# Altium project GAP_Shield.PrjPcb
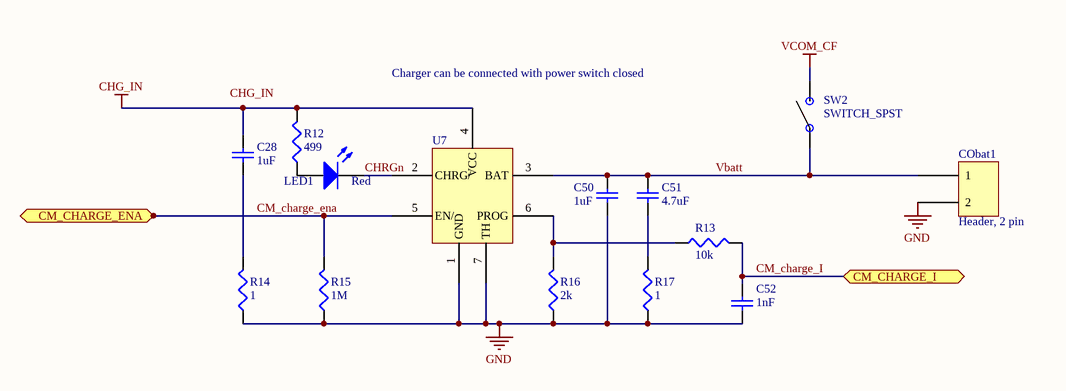
[diagram p0: BatteryCharge.SchDoc]
4 sheets, 110 parts. Net scope: global (net labels, ports and power ports of the same name join across sheets).
Board file: PCB1.PcbDoc
Sheets:
  BatteryCharge.SchDoc
  Power.SchDoc
  GAPandPeripherals.SchDoc
  Communications.SchDoc

## Sheet BatteryCharge.SchDoc
size A4

### Parts
C28  value 1uF  [0402]  (hidden comment: C1005X5R1C105M050BC)
C50  value 1uF  [0402]  (hidden comment: C1005X5R1C105M050BC)
C51  value 4.7uF  [0402]  (hidden comment: GRM188R6YA475KE15D)
C52  value 1nF  [0402]  (hidden comment: GRM155R61H102KA01D)
CObat1  Header, 2 pin  [Pin Header, 1x2, TH]
LED1  Color: Red  [0603]
R12  value 499  [0402]  (hidden comment: ERJ-2RKF4990X)
R13  value 10k  [0402]  (hidden comment: ERJ-2RKF1002X)
R14  value 1  [0402]  (hidden comment: ERJ-2BQF1R0X)
R15  value 1M  [0402]  (hidden comment: ERJ-2RKF1004X)
R16  value 2k  [0402]  (hidden comment: ERJ-2RKF2001X)
R17  value 1  [0402]  (hidden comment: ERJ-2BQF1R0X)
SW2  SWITCH_SPST  [SWITCH_SPST_CHS-01TB]
U7  LTC4065EDC#TRMPBF  [DFN-6_LT]  (value not drawn)

### Ports
CM_CHARGE_ENA (bidir), CM_CHARGE_I (bidir)

### Nets
CHG_IN: C28.2 R12.2 U7.4(VCC)
GND: C50.1 C52.1 CObat1.2 R14.1 R15.1 R16.1 R17.1 U7.1(GND) U7.7(TH)
VCOM_CF: SW2.1
CHRGn: LED1.2(K) U7.2(CHRG/)
CM_charge_ena: R15.2 U7.5(EN/) ; port CM_CHARGE_ENA
CM_charge_I: C52.2 R13.2 ; port CM_CHARGE_I
Vbatt: C50.2 C51.2 CObat1.1 SW2.2 U7.3(BAT)
NetC28_1: C28.1 R14.2
NetC51_1: C51.1 R17.2
NetLED1_1: LED1.1(A) R12.1
NetR13_1: R13.1 R16.2 U7.6(PROG)

### Notes on the sheet
- Charger can be connected with power switch closed
- Labels drawn without touching a wire or pin: CHG_IN

### Library data of the parts
C28 C50 = Cap: CAP CER 1UF 16V X5R 0402; Manufacturer: TDK; Supplier: Digikey; Supplier PN: 445-9073-1-ND; Manufacturer PN: C1005X5R1C105M050BC
C51 = Cap: CAP CER 4.7UF 35V X5R 0603; Manufacturer: Murata; Supplier: Digikey; Supplier PN: 490-7205-1-ND; Manufacturer PN: GRM188R6YA475KE15D
C52 = Cap: CAP CER 1000PF 50V X5R 0402; Manufacturer: Murata; Supplier: Digikey; Supplier PN: 490-6316-1-ND; Manufacturer PN: GRM155R61H102KA01D
CObat1 = Header, 2 pin: Header 1x2; Manufacturer: Samtec; Manufacturer PN: TMM-102-03-T-S; Supplier: Digikey; Supplier PN: SAM8977-ND
LED1 = LED: LED RED CLEAR 0603 SMD; Manufacturer: Rohm; Manufacturer PN: SML-311UTT86; Supplier: Digikey; Supplier PN: 511-1304-1-ND
R12 = Resistor: RES SMD 499 OHM 1% 1/10W 0402; Manufacturer: Panasonic; Manufacturer PN: ERJ-2RKF4990X; Supplier: Digikey; Supplier P/N: P499LCT-ND; Power: 1/10W; Package: 0402
R13 = Resistor: RES SMD 10K OHM 1% 1/10W 0402; Manufacturer: Panasonic; Manufacturer PN: ERJ-2RKF1002X; Supplier: Digikey; Supplier P/N: P10.0KLCT-ND; Power: 1/10W; Package: 0402
R14 R17 = Resistor: RES SMD 1 OHM 1% 1/6W 0402; Manufacturer: Panasonic; Manufacturer PN: ERJ-2BQF1R0X; Supplier: Digikey; Supplier P/N: P17252CT-ND; Power: 1/6W; Package: 0402
R15 = Resistor: RES SMD 1M OHM 1% 1/10W 0402; Manufacturer: Panasonic; Manufacturer PN: ERJ-2RKF1004X; Supplier: Digikey; Supplier P/N: P1.00MLCT-ND; Power: 1/10W; Package: 0402
R16 = Resistor: RES SMD 2K OHM 1% 1/10W 0402; Manufacturer: Panasonic; Manufacturer PN: ERJ-2RKF2001X; Supplier: Digikey; Supplier P/N: P2.00KLCT-ND; Power: 1/10W; Package: 0402
SW2 = SWITCH_SPST: SWITCH SLIDE DIP SPST 100MA 6V; Manufacturer: Copal; Manufacturer PN: CHS-01TB; Supplier: Digikey; Supplier PN: 563-1004-1-ND
U7 = LTC4065EDC: IC CHARGER BATT LI-ON 6-DFN; Manufacturer: LT; Note: 4.4v float version is available (4.2 is standard): LTC4065EDC-4.4; Manufacturer PN: LTC4065EDC#TRMPBF; Supplier: Digikey; Supplier PN: LTC4065EDC#TRMPBFCT-ND

## Sheet Power.SchDoc: PULP - shield - GAP
size A4; Revision: 1.1; SheetNumber: 2; SheetTotal: 2
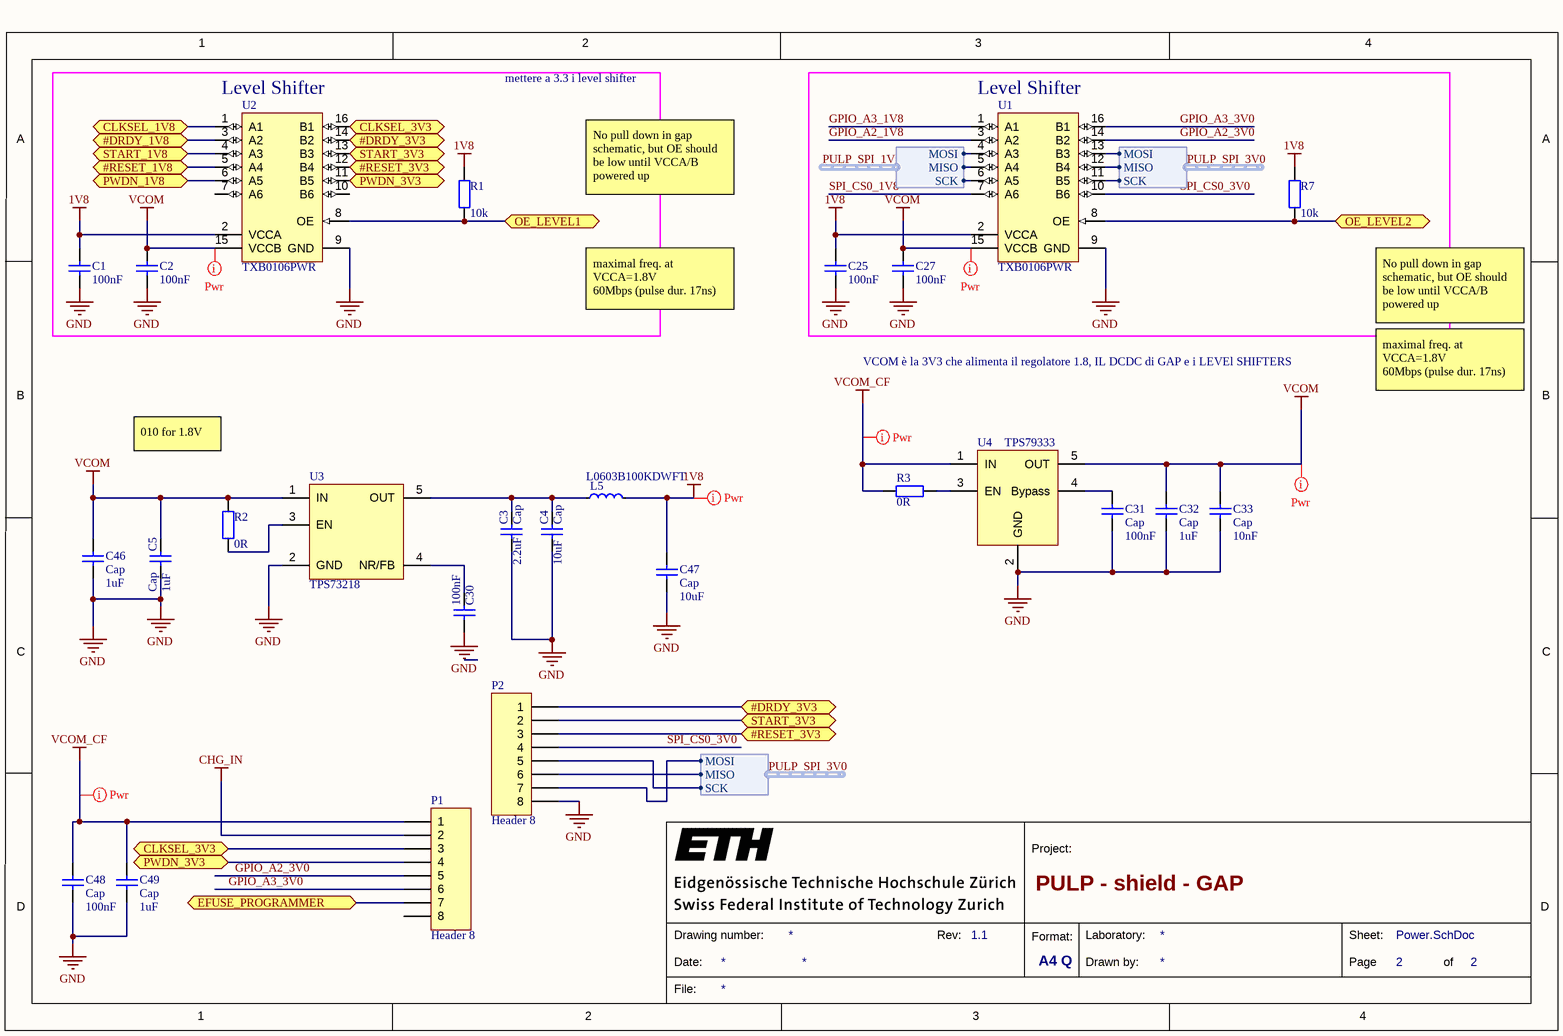
[diagram p1: Power.SchDoc]

### Parts
C1  100nF  [CAPC0402(1005)60_N]
C2  100nF  [CAPC0402(1005)60_N]
C3  Cap  value 2.2uF  [cap_0402_R - modified]
C4  Cap  value 10uF  [cap_0402_R - modified]
C5  Cap  value 1uF  [cap_0402_R - modified]
C25  100nF  [CAPC0402(1005)60_N]
C27  100nF  [CAPC0402(1005)60_N]
C30  value 100nF  [cap_0402_R - modified]  (hidden comment: C)
C31  Cap  value 100nF  [cap_0402_R - modified]
C32  Cap  value 1uF  [cap_0402_R - modified]
C33  Cap  value 10nF  [cap_0402_R - modified]
C46  Cap  value 1uF  [CAPC0402(1005)60_N]
C47  Cap  value 10uF  [CAPC0402(1005)60_N]
C48  Cap  value 100nF  [cap_0402_R - modified]
C49  Cap  value 1uF  [cap_0402_R - modified]
L5  L0603B100KDWFT  [SMD 0805_A]
P1  Header 8  [HDR1X8]
P2  Header 8  [HDR1X8]
R1  value 10k  [cap_0402_R - modified]  (hidden comment: R)
R2  value 0R  [cap_0402_R - modified]  (hidden comment: R)
R3  value 0R  [cap_0402_R - modified]  (hidden comment: R)
R7  value 10k  [cap_0402_R - modified]  (hidden comment: R)
U1  TXB0106PWR  [PW0016A_L]
U2  TXB0106PWR  [PW0016A_L]
U3  TPS73218  [SOT23__DDC__(R - PDSO-  G5)]
U4  TPS79333  [SOT_23__DBV_(R - PDSO - G5)]

### Blocks framed on the sheet
Level Shifter: C1 C2 R1 U2
Level Shifter: C25 C27 R7 U1

### Ports
#DRDY_1V8, #DRDY_3V3, #RESET_1V8, #RESET_3V3, CLKSEL_1V8, CLKSEL_3V3, EFUSE_PROGRAMMER, OE_LEVEL1, OE_LEVEL2, PWDN_1V8, PWDN_3V3, START_1V8, START_3V3

### Harnesses
SPI: SCK, MISO, MOSI

### Nets
1V8: C1.2 C25.2 C47.2 L5.2 R1.2 R7.2 U1.2(VCCA) U2.2(VCCA)
CHG_IN: P1.2
GND: C1.1 C2.2 C3.2 C4.2 C5.2 C25.1 C27.2 C30.2 C31.1 C32.2 C33.1 C46.1 C47.1 C48.1 C49.2 P2.8 U1.9(GND) U2.9(GND) U3.2(GND) U4.2(GND)
VCOM: C2.1 C5.1 C27.1 C32.1 C33.2 C46.2 R2.2 U1.15(VCCB) U2.15(VCCB) U3.1(IN) U4.5(OUT)
VCOM_CF: C48.2 C49.1 P1.1 R3.2 U4.1(IN)
GPIO_A2_1V8: U1.3(A2)
GPIO_A2_3V0: P1.5 U1.14(B2)
GPIO_A3_1V8: U1.1(A1)
GPIO_A3_3V0: P1.6 U1.16(B1)
PULP_SPI_1V8.MISO: U1.5(A4) ; harness SPI.MISO
PULP_SPI_1V8.MOSI: U1.4(A3) ; harness SPI.MOSI
PULP_SPI_1V8.SCK: U1.6(A5) ; harness SPI.SCK
PULP_SPI_3V0.MISO: P2.6 U1.12(B4) ; harness SPI.MISO
PULP_SPI_3V0.MOSI: P2.7 U1.13(B3) ; harness SPI.MOSI
PULP_SPI_3V0.SCK: P2.5 U1.11(B5) ; harness SPI.SCK
SPI_CS0_1V8: U1.7(A6)
SPI_CS0_3V0: P2.4 U1.10(B6)
NetC3_1: C3.1 C4.1 L5.1 U3.5(OUT)
NetC30_1: C30.1 U3.4(NR/FB)
NetC31_2: C31.2 U4.4(Bypass)
NetJ2_1: P1.7 ; port EFUSE_PROGRAMMER
NetP1_3: P1.3 U2.16(B1) ; port CLKSEL_3V3
NetP1_4: P1.4 U2.11(B5) ; port PWDN_3V3
NetP2_1: P2.1 U2.14(B2) ; port #DRDY_3V3
NetP2_2: P2.2 U2.13(B3) ; port START_3V3
NetP2_3: P2.3 U2.12(B4) ; port #RESET_3V3
NetR1_1: R1.1 U2.8(OE) ; port OE_LEVEL1
NetR2_1: R2.1 U3.3(EN)
NetR3_1: R3.1 U4.3(EN)
NetR7_1: R7.1 U1.8(OE) ; port OE_LEVEL2
NetR11_2: U2.3(A2) ; port #DRDY_1V8
NetU2_1: U2.1(A1) ; port CLKSEL_1V8
NetU2_4: U2.4(A3) ; port START_1V8
NetU2_5: U2.5(A4) ; port #RESET_1V8
NetU2_6: U2.6(A5) ; port PWDN_1V8

Not connected (* = marked no-connect by the designer): P1 8; U2 7(A6) 10(B6)

### Layout directives
net class POWER: 1V8, VCOM, VCOM_CF

### Notes on the sheet
- mettere a 3.3 i level shifter
- No pull down in gap schematic, but OE should be low until VCCA/B powered up
- maximal freq. at VCCA=1.8V
  60Mbps (pulse dur. 17ns)
- VCOM è la 3V3 che alimenta il regolatore 1.8, IL DCDC di GAP e i LEVEl SHIFTERS
- 010 for 1.8V
- 1
- 2
- 3
- 4
- A
- B
- C
- Project:
- D
- Date:
- Drawing number:
- Rev:
- Format:
- A4 Q
- Drawn by:
- Laboratory:
- Page
- Sheet:
- of
- File:

### Library data of the parts
C1 C2 C25 C27 = CMP-1034-02065-1: CAP 100nF 10V ±10% 0402 (1005 Metric) Thickness 0.6mm SMD; Case-EIA: 0402; Case-Metric: 1005; Tolerance: Â±10%; Max Thickness: 0.6 mm; Value: 100nF; Rated Voltage: 10 V; Technology: SMT
C3-C5 C30-C33 C46-C49 = Cap: Capacitor; Published: 8-Jun-2000; LatestRevisionDate: 17-Jul-2002; LatestRevisionNote: Re-released for DXP Platform.; PackageReference: RAD-0.3; Publisher: Altium Limited; PackageDescription: Radial Cap, Thru-Hole; 2 Leads; 0.3 in Pin Spacing
L5 = IND: Power Multilayer Inductor WE-PMI, L=2.20 µH; Part Number: L0603-10µ; Manufacturer: Taiyo Yuden; Manufacturer Part Number: LBMF1608T100K; 2nd source part number: 178-6105; Value: 2.2µH; Note: LBMF1608T100K 10µH 80mA 0603; Artikkelnr Noca: 33029314; Artikkelnr Simpro: N.A.; Datasheet: http://www.yuden.co.jp/ut/product/pdf/elb2_e.pdf; LatestRevisionDate: 2012-09-19; Pin Count: 2; Publisher: Nordic Semiconductor; Published: 2010-02-24; Supplier: Digi-Key; Supplier part number: 587-1714-1-ND; 2nd source Supplier: Farnell; Footprint Doc: Power Multilayer Inductor WE-PMI, L=2.20 µH
P1 P2 = Header 8: Header, 8-Pin; LatestRevisionDate: 17-Jul-2002; LatestRevisionNote: Re-released for DXP Platform.; Publisher: Altium Limited
R1-R3 R7 = Res2: Resistor; Published: 8-Jun-2000; LatestRevisionDate: 17-Jul-2002; LatestRevisionNote: Re-released for DXP Platform.; PackageReference: AXIAL-0.4; Publisher: Altium Limited; PackageDescription: Axial Device, Thru-Hole; 2 Leads; 0.4 in Pin Spacing
U1 U2 = TI-TXB0106-TSSOP_PW-16: 6-Bit Bidirectional Level-Shifting and Voltage Translator with Auto-Direction Sensing and +/- 15-kV ESD Protection, 1.2 to 3.6 V, -40 to 85 degC, 16-Pin TSSOP (PW), Green (RoHS & no Sb/Br), Tape and Reel; Manufacturer: Texas Instruments; Dynamic Catalog: TXBSeries; Differential - Input: Output:No/No; Number of Bits: 6; Output Type: Logic; Propagation Delay (Max): 4ns; Number of Outputs/Channel: 1; Voltage - Supply: 1.2V~3.6V,1.65V~5.5V; Data Rate: 100Mbps; Product Training Modules: VoltageLevelTranslation; Other Names: 296-23759-1; Logic Function: Translator,Bidirectional; Packaging: CutTape(CT); Datasheet URL: http://www.ti.com/general/docs/lit/getliterature.tsp?genericPartNumber=TXB0106&fileType=pdf; Package Description: 16-Pin Small Outline Package Integrated Circuit, Body 5 x 4.4 mm, Pitch 0.65 mm; Standard Package: 1; Series: -; Manufacturer URL: http://www.ti.com/; Operating Temperature: -40°C~85°C; Supplier Device Package: 16-TSSOP; Package Reference: PW16; Number of Channels: 6; Category: IntegratedCircuits(ICs); Package / Case: 16-TSSOP(0.173",4.40mmWidth); Family: Logic-Translators; Datasheet Version: Rev. B, 06/2015; Mounting Technology: SurfaceMount; Input Type: Logic
U3 = TPS73225: Linear Regulator
U4 = TPS79333: Regulator

## Sheet GAPandPeripherals.SchDoc: PULP - shield - GAP
size A3; Revision: 1.1; SheetNumber: 1; SheetTotal: 2
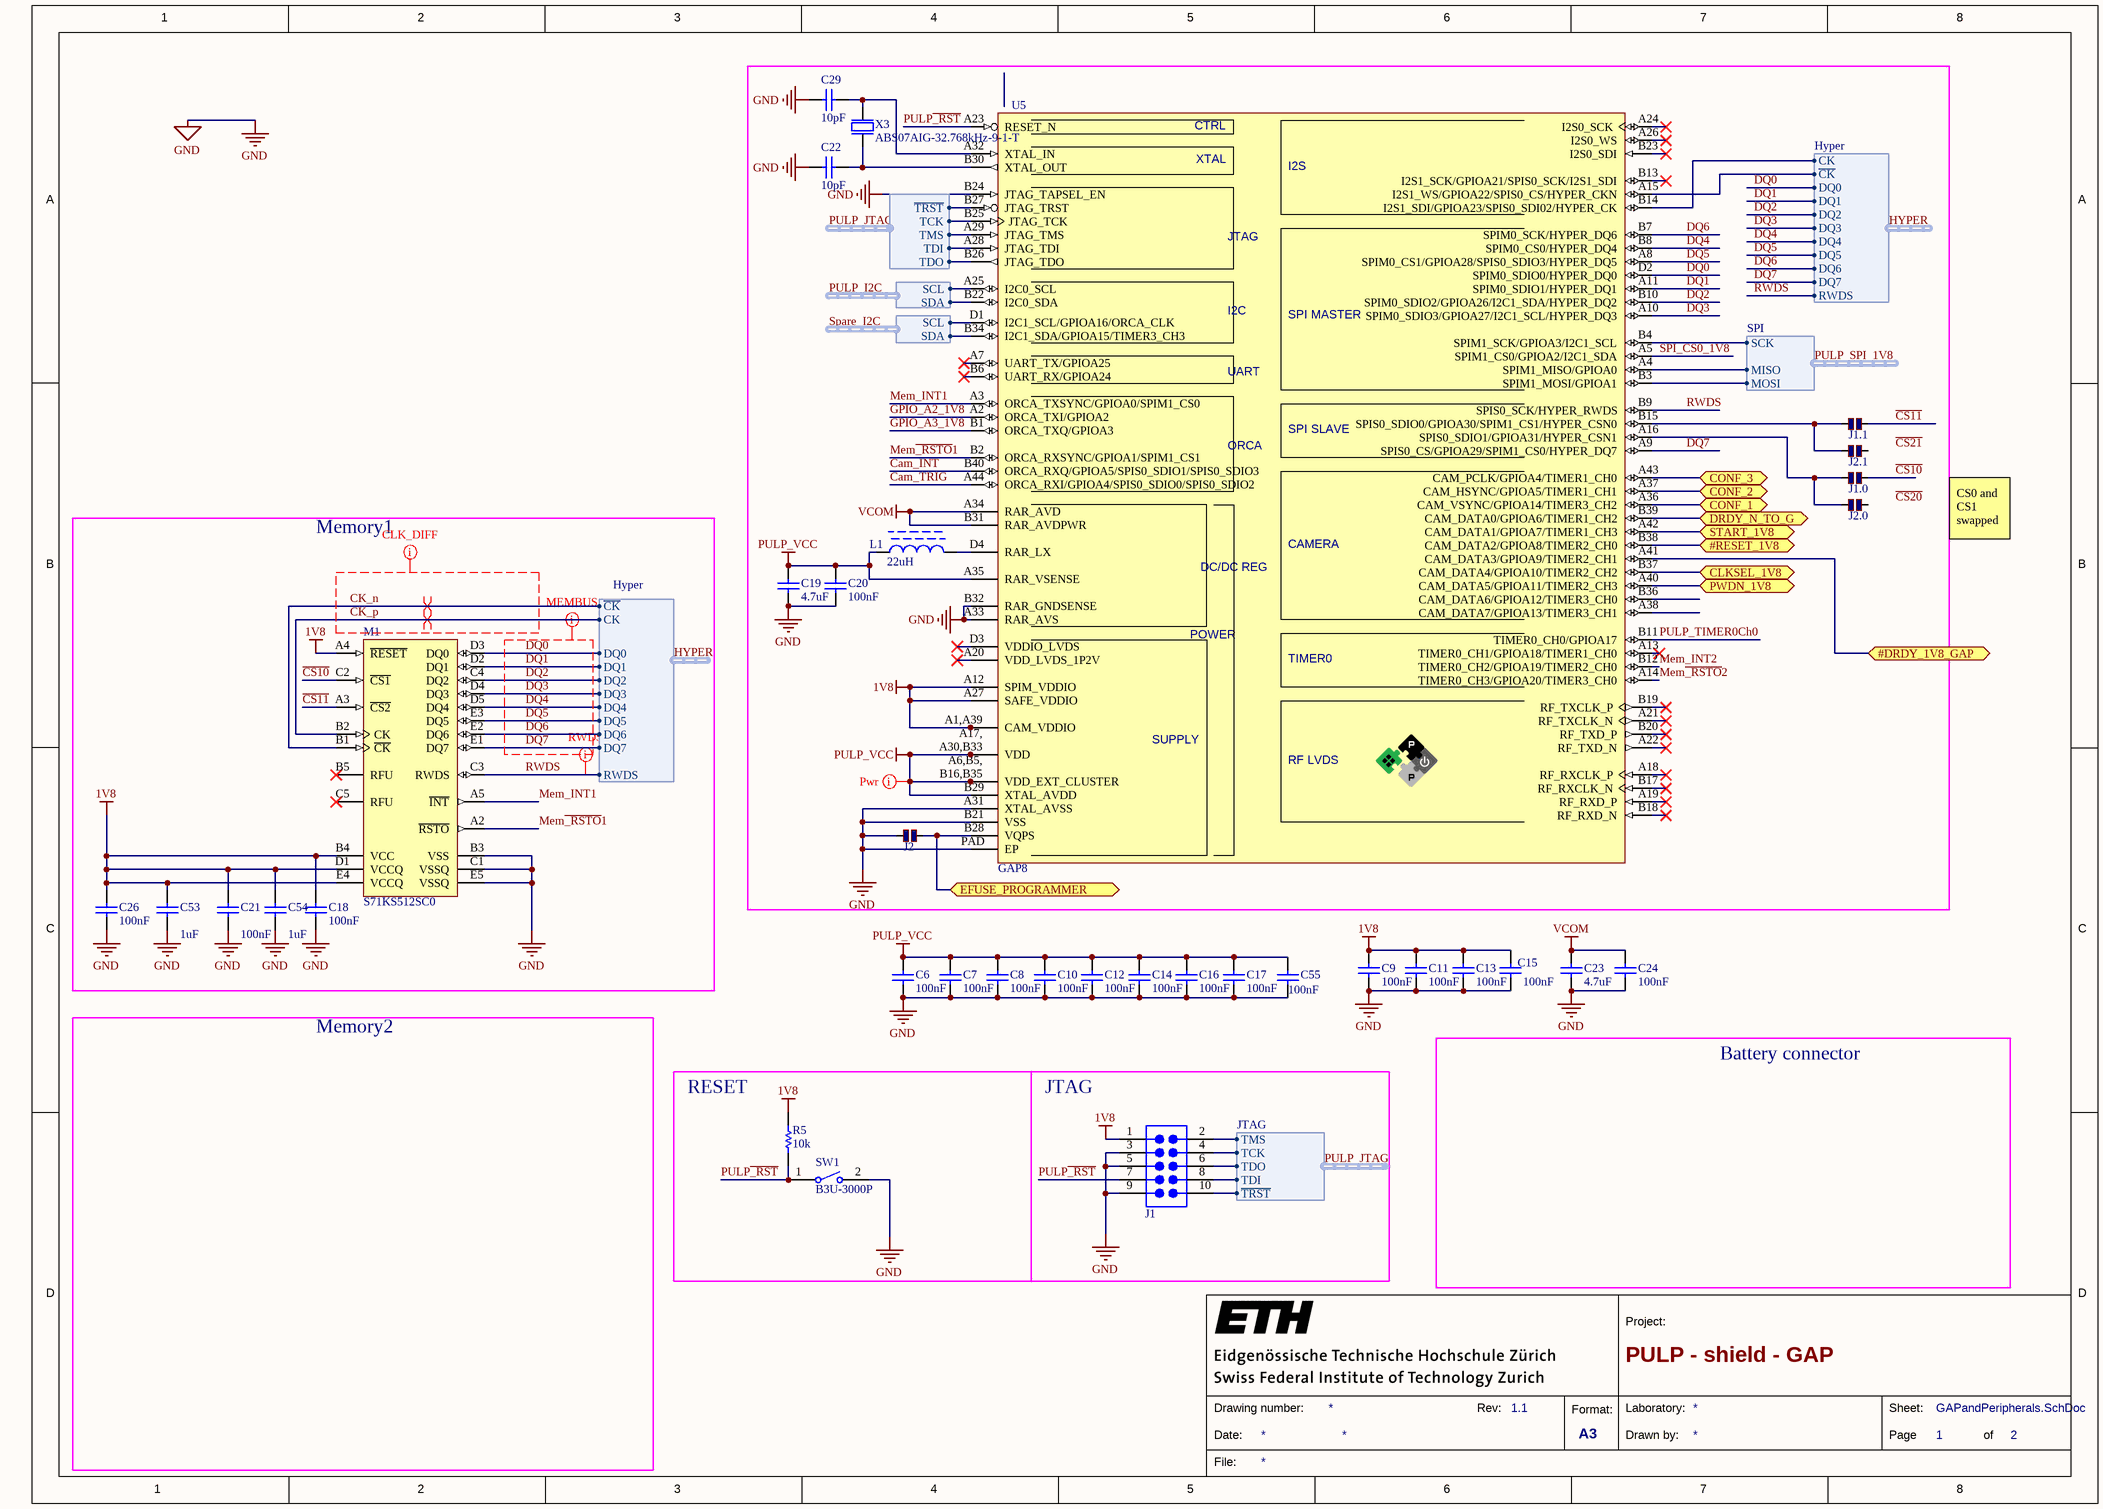
[diagram p2: GAPandPeripherals.SchDoc]

### Parts
C6  100nF  [CAPC0402(1005)60_N]
C7  100nF  [CAPC0402(1005)60_N]
C8  100nF  [CAPC0402(1005)60_N]
C9  100nF  [CAPC0402(1005)60_N]
C10  100nF  [CAPC0402(1005)60_N]
C11  100nF  [CAPC0402(1005)60_N]
C12  100nF  [CAPC0402(1005)60_N]
C13  100nF  [CAPC0402(1005)60_N]
C14  100nF  [CAPC0402(1005)60_N]
C15  100nF  [CAPC0402(1005)60_N]
C16  100nF  [CAPC0402(1005)60_N]
C17  100nF  [CAPC0402(1005)60_N]
C18  100nF  [CAPC0402(1005)60_N]
C19  4.7uF  [CAPC0402(1005)60_N]
C20  100nF  [CAPC0402(1005)60_N]
C21  value 100nF  [0402]  (hidden comment: Cap Semi)
C22  10pF  [CAPC0402(1005)60_L]
C23  4.7uF  [CAPC0402(1005)60_N]
C24  100nF  [CAPC0402(1005)60_N]
C26  100nF  [CAPC0402(1005)60_N]
C29  10pF  [CAPC0402(1005)60_L]
C53  value 1uF  [0402]  (hidden comment: Cap Semi)
C54  value 1uF  [0402]  (hidden comment: Cap Semi)
C55  value 100nF  [0402]  (hidden comment: Cap Semi)
J1  20021111-00010T4LF  [20021111-00010T4LF]  (value not drawn)
J1.0  Solder Jumper  [UJMPR]  (value not drawn)
J1.1  Solder Jumper  [UJMPR]  (value not drawn)
J2  Solder Jumper  [Small Solder Jumper 2]  (value not drawn)
J2.0  Solder Jumper  [UJMPR]  (value not drawn)
J2.1  Solder Jumper  [UJMPR]  (value not drawn)
L1  value 22uH  [SRN4026]  (hidden comment: SRN4026-220M)
M1  S71KS512SC0  [FBGA24_A-130]
R5  10k  [RESC1005X40X25NL05T05]
SW1  B3U-3000P  [OMRON-B3U-3000P_V]
U5  GAP8  [RKC0088A_V]
X3  ABS07AIG-32.768kHz-9-1-T  [ABRA-ABS07-2_V]

### Blocks framed on the sheet
Memory1: C18 C21 C26 C53 C54 M1
RESET: R5 SW1
JTAG: J1

### Ports
#DRDY_1V8_GAP, #RESET_1V8, CLKSEL_1V8, CONF_1, CONF_2, CONF_3, DRDY_N_TO_G, EFUSE_PROGRAMMER, PWDN_1V8, START_1V8

### Harnesses
Hyper: CK, ~{CK}, DQ0, DQ1, DQ2, DQ3, DQ4, DQ5, DQ6, DQ7, RWDS
JTAG: ~{TRST}, TMS, TDO, TDI, TCK
I2C: SDA, SCL
SPI: SCK, MISO, MOSI

### Nets
1V8: C9.2 C11.2 C13.2 C15.2 C18.2 C21.2 C26.2 C53.2 C54.2 J1.1 M1.A4(~{RESET}) M1.B4(VCC) M1.D1(VCCQ) M1.E4(VCCQ) R5.2 U5.A1(CAM_VDDIO) U5.A12(SPIM_VDDIO) U5.A27(SAFE_VDDIO) U5.A39(CAM_VDDIO)
GND: C6.1 C7.1 C8.1 C9.1 C10.1 C11.1 C12.1 C13.1 C14.1 C15.1 C16.1 C17.1 C18.1 C19.1 C20.1 C21.1 C22.1 C23.1 C24.1 C26.1 C29.1 C53.1 C54.1 C55.1 J1.3 J1.5 J1.9 J2.2 M1.B3(VSS) M1.C1(VSSQ) M1.E5(VSSQ) SW1.2 U5.A31(XTAL_AVSS) U5.A33(RAR_AVS) U5.B21(VSS) U5.B24(JTAG_TAPSEL_EN) U5.B32(RAR_GNDSENSE) U5.PAD(EP)
PULP_VCC: C6.2 C7.2 C8.2 C10.2 C12.2 C14.2 C16.2 C17.2 C19.2 C20.2 C55.2 L1.1 U5.A6(VDD_EXT_CLUSTER) U5.A17(VDD) U5.A30(VDD) U5.A35(RAR_VSENSE) U5.B5(VDD_EXT_CLUSTER) U5.B16(VDD_EXT_CLUSTER) U5.B29(XTAL_AVDD) U5.B33(VDD) U5.B35(VDD_EXT_CLUSTER)
VCOM: C23.2 C24.2 U5.A34(RAR_AVD) U5.B31(RAR_AVDPWR)
~{CS10}: J1.0.2 M1.C2(~{CS1})
~{CS11}: J1.1.2 M1.A3(~{CS2})
Cam_INT: U5.B40(ORCA_RXQ/GPIOA5/SPIS0_SDIO1/SPIS0_SDIO3)
Cam_TRIG: U5.A44(ORCA_RXI/GPIOA4/SPIS0_SDIO0/SPIS0_SDIO2)
CK_n: M1.B1(~{CK}) U5.A15(I2S1_WS/GPIOA22/SPIS0_CS/HYPER_CKN) ; harness Hyper.~{CK}
CK_p: M1.B2(CK) U5.B14(I2S1_SDI/GPIOA23/SPIS0_SDI02/HYPER_CK) ; harness Hyper.CK
DQ0: M1.D3(DQ0) U5.D2(SPIM0_SDIO0/HYPER_DQ0) ; harness Hyper.DQ0
DQ1: M1.D2(DQ1) U5.A11(SPIM0_SDIO1/HYPER_DQ1) ; harness Hyper.DQ1
DQ2: M1.C4(DQ2) U5.B10(SPIM0_SDIO2/GPIOA26/I2C1_SDA/HYPER_DQ2) ; harness Hyper.DQ2
DQ3: M1.D4(DQ3) U5.A10(SPIM0_SDIO3/GPIOA27/I2C1_SCL/HYPER_DQ3) ; harness Hyper.DQ3
DQ4: M1.D5(DQ4) U5.B8(SPIM0_CS0/HYPER_DQ4) ; harness Hyper.DQ4
DQ5: M1.E3(DQ5) U5.A8(SPIM0_CS1/GPIOA28/SPIS0_SDIO3/HYPER_DQ5) ; harness Hyper.DQ5
DQ6: M1.E2(DQ6) U5.B7(SPIM0_SCK/HYPER_DQ6) ; harness Hyper.DQ6
DQ7: M1.E1(DQ7) U5.A9(SPIS0_CS/GPIOA29/SPIM1_CS0/HYPER_DQ7) ; harness Hyper.DQ7
GPIO_A2_1V8: U5.A2(ORCA_TXI/GPIOA2)
GPIO_A3_1V8: U5.B1(ORCA_TXQ/GPIOA3)
Mem~{_RSTO}1: M1.A2(~{RSTO}) U5.B2(ORCA_RXSYNC/GPIOA1/SPIM1_CS1)
Mem~{_RSTO}2: U5.A14(TIMER0_CH3/GPIOA20/TIMER3_CH0)
Mem_INT1: M1.A5(~{INT}) U5.A3(ORCA_TXSYNC/GPIOA0/SPIM1_CS0)
Mem_INT2: U5.B12(TIMER0_CH2/GPIOA19/TIMER2_CH0)
PULP~{_RST}: J1.7 R5.1 SW1.1 U5.A23(RESET_N)
PULP_I2C.SCL: U5.A25(I2C0_SCL) ; harness I2C.SCL
PULP_I2C.SDA: U5.B22(I2C0_SDA) ; harness I2C.SDA
PULP_JTAG~{.TRST}: J1.10 U5.B27(JTAG_TRST) ; harness JTAG.~{TRST}
PULP_JTAG.TCK: J1.4 U5.B25(JTAG_TCK) ; harness JTAG.TCK
PULP_JTAG.TDI: J1.8 U5.A28(JTAG_TDI) ; harness JTAG.TDI
PULP_JTAG.TDO: J1.6 U5.B26(JTAG_TDO) ; harness JTAG.TDO
PULP_JTAG.TMS: J1.2 U5.A29(JTAG_TMS) ; harness JTAG.TMS
PULP_SPI_1V8.MISO: U5.A4(SPIM1_MISO/GPIOA0) ; harness SPI.MISO
PULP_SPI_1V8.MOSI: U5.B3(SPIM1_MOSI/GPIOA1) ; harness SPI.MOSI
PULP_SPI_1V8.SCK: U5.B4(SPIM1_SCK/GPIOA3/I2C1_SCL) ; harness SPI.SCK
PULP_TIMER0Ch0: U5.B11(TIMER0_CH0/GPIOA17)
RWDS: M1.C3(RWDS) U5.B9(SPIS0_SCK/HYPER_RWDS) ; harness Hyper.RWDS  [project net HYPER.RWDS]
Spare_I2C.SCL: U5.D1(I2C1_SCL/GPIOA16/ORCA_CLK) ; harness I2C.SCL
Spare_I2C.SDA: U5.B34(I2C1_SDA/GPIOA15/TIMER3_CH3) ; harness I2C.SDA
SPI_CS0_1V8: U5.A5(SPIM1_CS0/GPIOA2/I2C1_SDA)
NetC22_2: C22.2 U5.B30(XTAL_OUT) X3.1(inp)
NetC29_2: C29.2 U5.A32(XTAL_IN) X3.2(out)
NetJ1.0_1: J1.0.1 J2.0.1 U5.A16(SPIS0_SDIO1/GPIOA31/HYPER_CSN1)
NetJ1.1_1: J1.1.1 J2.1.1 U5.B15(SPIS0_SDIO0/GPIOA30/SPIM1_CS1/HYPER_CSN0)
NetJ2_1: J2.1 U5.B28(VQPS) ; port EFUSE_PROGRAMMER
NetL1_2: L1.2 U5.D4(RAR_LX)
NetR11_1: U5.A41(CAM_DATA3/GPIOA9/TIMER2_CH1) ; port #DRDY_1V8_GAP
NetU2_1: U5.B37(CAM_DATA4/GPIOA10/TIMER2_CH2) ; port CLKSEL_1V8
NetU2_4: U5.A42(CAM_DATA1/GPIOA7/TIMER1_CH3) ; port START_1V8
NetU2_5: U5.B38(CAM_DATA2/GPIOA8/TIMER2_CH0) ; port #RESET_1V8
NetU2_6: U5.A40(CAM_DATA5/GPIOA11/TIMER2_CH3) ; port PWDN_1V8
NetU5_A36: U5.A36(CAM_VSYNC/GPIOA14/TIMER3_CH2) ; port CONF_1
NetU5_A37: U5.A37(CAM_HSYNC/GPIOA5/TIMER1_CH1) ; port CONF_2
NetU5_A43: U5.A43(CAM_PCLK/GPIOA4/TIMER1_CH0) ; port CONF_3
NetU5_B39: U5.B39(CAM_DATA0/GPIOA6/TIMER1_CH2) ; port DRDY_N_TO_G

Not connected (* = marked no-connect by the designer): J2.0 2; J2.1 2; M1 B5(RFU)* C5(RFU)*; U5 A7(UART_TX/GPIOA25)* A13(TIMER0_CH1/GPIOA18/TIMER1_CH0)* A18(RF_RXCLK_P)* A19(RF_RXD_P)* A20(VDD_LVDS_1P2V)* A21(RF_TXCLK_N)* A22(RF_TXD_N)* A24(I2S0_SCK)* A26(I2S0_WS)* A38(CAM_DATA7/GPIOA13/TIMER3_CH1) B6(UART_RX/GPIOA24)* B13(I2S1_SCK/GPIOA21/SPIS0_SCK/I2S1_SDI)* B17(RF_RXCLK_N)* B18(RF_RXD_N)* B19(RF_TXCLK_P)* B20(RF_TXD_P)* B23(I2S0_SDI)* B36(CAM_DATA6/GPIOA12/TIMER3_CH0) D3(VDDIO_LVDS)*

### Layout directives
differential pair: CK_n, CK_p
net class POWER: PULP_VCC
net class CLOCKDIFF: CK_n, CK_p
net class D0_7: DQ0, DQ1, DQ2, DQ3, DQ4, DQ5, DQ6, DQ7
net class RWDS_NET: HYPER.RWDS

### Notes on the sheet
- CS0 and CS1 swapped
- Memory2
- Battery connector
- Labels drawn without touching a wire or pin: ~{CS20}, ~{CS21}
- 1
- 2
- 3
- 4
- 5
- 6
- 7
- 8
- A
- B
- C
- D
- Project:
- Date:
- Drawing number:
- Rev:
- Format:
- A3
- Drawn by:
- Laboratory:
- Page
- Sheet:
- of
- File:
- (in symbol CMP-01034-2) CTRL; XTAL; I2S; JTAG; I2C; SPI MASTER; UART; ORCA; SPI SLAVE; CAMERA; DC/DC REG; POWER; TIMER0; A1,A39; A17,; SUPPLY; A30,B33; A6,B5,; RF LVDS; B16,B35

### Library data of the parts
C6-C18 C20 C24 C26 = CMP-1034-02065-1: as C1 on sheet Power; Max Thickness: 0.6 mm; Value: 100nF; Rated Voltage: 10 V; Technology: SMT
C19 C23 = CMP-1034-02137-1: CAP 4.7uF 6.3V ±20% 0402 (1005 Metric) Thickness 0.6mm SMD; Case-Metric: 1005; Case-EIA: 0402; Tolerance: Â±20%; Technology: SMT; Max Thickness: 0.6 mm; Rated Voltage: 6.3 V; Value: 4.7uF
C21 C53-C55 = Cap Semi: Capacitor (Semiconductor SIM Model); Published: 8-Jun-2000; LatestRevisionDate: 29-May-2009; LatestRevisionNote: IPC-7351 Footprint Added.; PackageReference: C1206; Publisher: Altium Limited; PackageDescription: Chip Capacitor
C22 C29 = CMP-1034-00722-1: CAP 10pF 50V ±2% 0402 (1005 Metric) Thickness 0.6mm SMD; Tolerance: Â±2%; Case-Metric: 1005; Case-EIA: 0402; Technology: SMT; Value: 10pF; Max Thickness: 0.6 mm; Rated Voltage: 50 V
J1 = CON-5x2-Male: CONN HEADER VERT 10POS 1.27MM; Number of Contacts: 10; Insulation Resistance: 100MR; Current Rating: 10A; Voltage Rating: 125V; Contact Resistance: 30mR; Gender: Male; Row Spacing: 0.05inch; Stack Height: 2.5mm; Connector Type: Male Pin,Header; Contact Post Length: 2.3mm; Orientation: Straight; Lead Free: Lead Free; Max Operating Temperature: 85°C; Housing Material: Plastic; Package Quantity: 93; Packaging: Rail/Tube; Radiation Hardening: No; Contact Mating Length: 0.12inch; Mount: Through Hole; Max Voltage Rating (AC): 125V; Housing Color: Black; Contact Plating: Gold; Pitch: 1.27mm; Color: Black; Length: 6.35mm; Number of Positions: 10; Min Operating Temperature: -40°C; REACH SVHC: No SVHC; Termination: Solder; Number of Rows: 2; Contact Material: Nickel,Copper,Copper Alloy,Gold; Depth: 3.4mm
J1.0 J1.1 J2 J2.0 J2.1 = Solder Jumper: Value: 1; Technology: SMT
L1 = CMP-00905-1: Inductor Power Semi-Shielded Wirewound 22uH 20% 100KHz 11Q-Factor Ferrite 670mA 234mOhm DCR 1515 T/R; DC Resistance (DCR): 234mR; Self Resonant Frequency: 16MHz; Mount: Surface Mount; Case/Package: Nonstandard; Weight: 0.004938oz; Core Material: Ferrite; Min Operating Temperature: -40°C; Max Operating Temperature: 125°C; Packaging: Tape and Reel; Tolerance: 20%; Composition: Wirewound; Inductance: 22uh; Current Rating: 670mA; Saturation Current: 670mA; Shielding: Shielded; Test Frequency: 100kHz; Max DC Current: 670mA; Termination: SMD/SMT; RMS Current (Irms): 670mA; Inductance Tolerance: 20%; Package Quantity: 3000; Length: 4mm; Height: 2.5mm; Width: 4mm; Height - Seated (Max): 0.098inch; Depth: 4mm; REACH SVHC: No SVHC
M1 = CMP-00514-2: IC 512MB FLASH 64MB DRAM 24FBGA; Manufacturer: Cypress Semiconductor Corp; Memory Format: FLASH, RAM; Memory Type: Non-Volatile; Memory Size: 512Mbit Flash, 64Mbit RAM; Speed: 100MHz; Interface: Parallel, Serial; Voltage - Supply: 1.8V; Series: HyperFlash™ + HyperRAM™ KS; Package / Case: 24-VBGA; Supplier Device Package: 24-FBGA(6x8)
R5 = CMP-2002-00607-3: Chip Resistor, 10 KOhm, +/- 1%, 100 mW, -55 to 155 degC, 0402 (1005 Metric), RoHS, Tape and Reel; Manufacturer: Basic Passives; PartNumber: ERJ-2RKF1002X; Case\/Package: 0402; Resistance: 10 KOhm; Voltage Rating: 50 V; Power Rating: 100 mW; Packaging: Tape and Reel; Width: 0.5 mm; Package Quantity: 10000; Radiation Hardening: No; Min Operating Temperature: -55 degC; Case Code (Imperial): 0402; REACH SVHC: Yes; PackageDescription: 2-Pin Surface Mount Device, Body 1 x 0.5 mm; Length: 1 mm; ComponentLink1Description: Manufacturer URL; PackageReference: 0402; RoHSCompliant: true; ComponentLink1URL: http://www.panasonic.com/; Height: 0.35 mm; ComponentLink2Description: Datasheet; DatasheetVersion: 04/2015; Mounting Technology: Surface Mount; ComponentLink2URL: http://industrial.panasonic.com/cdbs/www-data/pdf/RDA0000/AOA0000C86.pdf; Max Operating Temperature: 155 degC; Pins: 2; Tolerance: 1%; Case Code (Metric): 1005; Mount: Surface Mount
SW1 = CMP-1677-00003-1: Ultra-Small Tactile Switch, 1 to 50 mA, 3 to 12 V, -25 to 70 degC, 2-Pin SMD, RoHS, Tape and Reel; Tolerance: 20%; Voltage Rating (DC): 50 V; Capacitance: 470 uF; Case\Package: Radial; PackageReference: B3U-3000P; Min Operating Temperature: -40 degC; Length: 20 mm; Mount: Through Hole; ComponentLink2Description: Datasheet; RoHSCompliant: true; ComponentLink1URL: http://www.omron.com/; Package Quantity: 200; Radiation Hardening: No; Height: 20 mm; ComponentLink2URL: https://www.omron.com/ecb/products/pdf/en-b3u.pdf; Diameter: 10 mm; Max Operating Temperature: 85 degC; Lead Pitch: 5 mm; DatasheetVersion: Jan-15; Packaging: Bulk; PackageDescription: 2-Pin Surface Mount Device, Body 4 x 3.2 mm; Voltage Rating: 50 V; Pins: 2; ComponentLink1Description: Manufacturer URL; REACH SVHC: No SVHC
U5 = CMP-01034-2: Package: QFN88
X3 = XTAL_2-pin: XTAL SMD 3215, 32.768kHz, Cl=9pF, Total Tol: ±50ppm; Part Number: XTAL_SMD3215_32.768kHz_9pF_General; Note: XTAL SMD 32.768kHz; Artikkelnr Noca: N.A.; Manufacturer: *; Manufacturer Part Number: *; Datasheet: *; LatestRevisionDate: 2016-08-19; Pin Count: 2; Publisher: Nordic Semiconductor; Published: 2016-08-19; Value: 32.768kHz; Supplier: *; Supplier part number: *; 2nd source Supplier: *; 2nd source part number: *; Footprint Doc: XTAL_3215; Artikkelnr Simpro: N.A.

## Sheet Communications.SchDoc
size A3
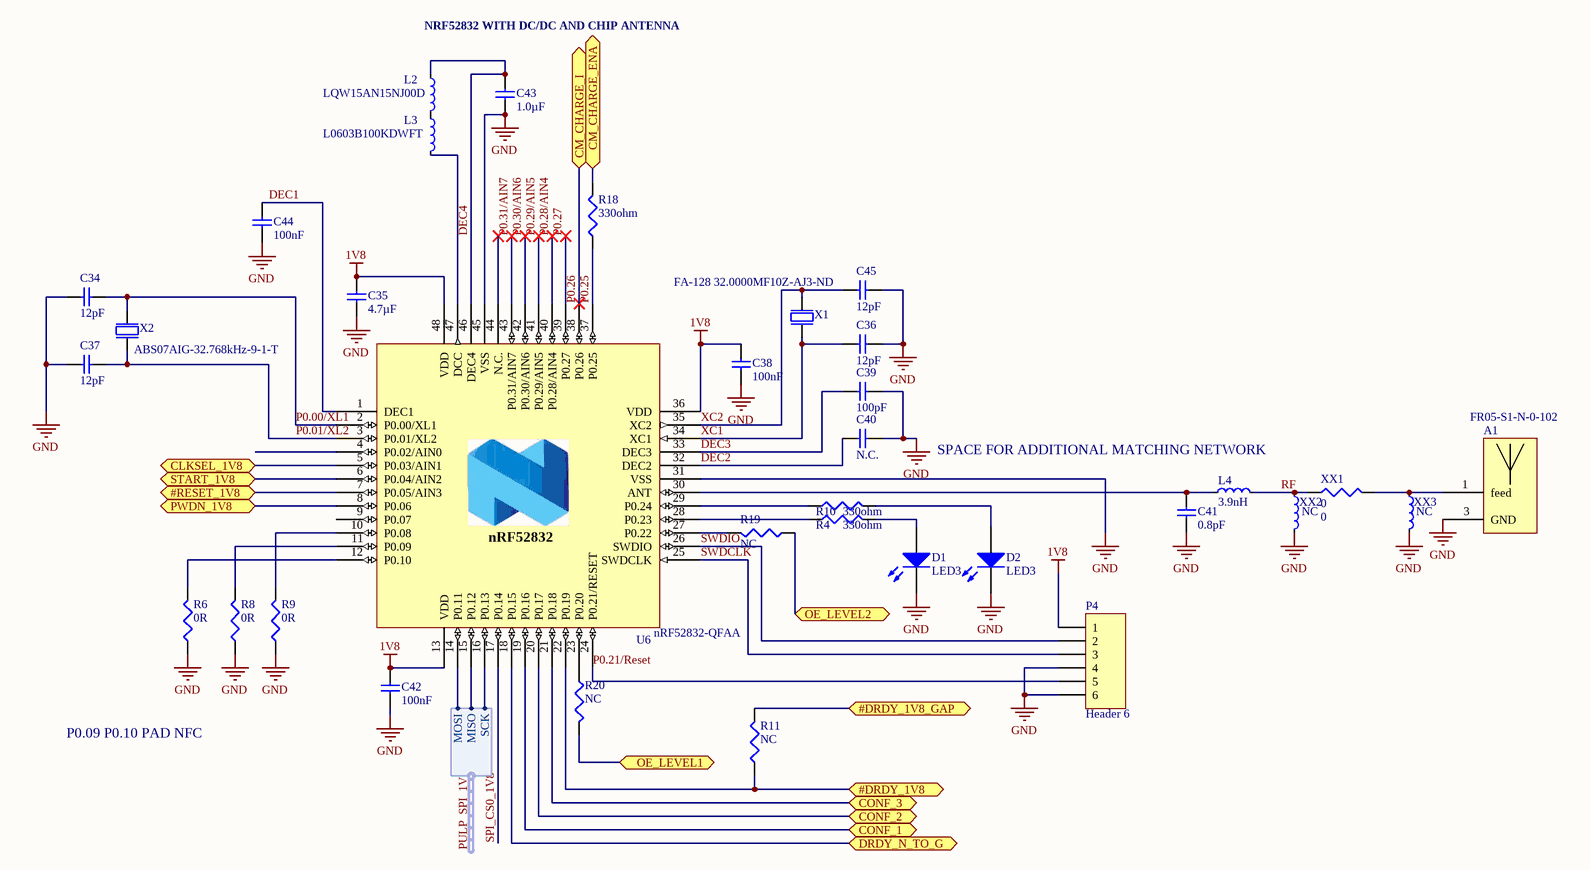
[diagram p3: Communications.SchDoc]

### Parts
A1  FR05-S1-N-0-102  [ANTENNACHIP]
C34  12pF  [CAPC1005X04L]
C35  4.7µF  [CAPC1608X06L]
C36  12pF  [CAPC1005X04L]
C37  12pF  [CAPC1005X04L]
C38  100nF  [CAPC1005X04L]
C39  100pF  [CAPC1005X04L]
C40  N.C.  [CAPC1005X04L]
C41  0.8pF  [CAPC1005X04L]
C42  100nF  [CAPC1005X04L]
C43  1.0µF  [CAPC1608X06L]
C44  100nF  [CAPC1005X04L]
C45  12pF  [CAPC1005X04L]
D1  LED3  [0603]
D2  LED3  [0603]
L2  LQW15AN15NJ00D  [INDC1005X04L]
L3  L0603B100KDWFT  [J1-0603]
L4  3.9nH  [INDC1005X04L]
P4  Header 6  [mini_6POLES_SWD]
R4  value 330ohm  [res_0402_R - modified]  (hidden comment: Res3)
R6  0R  [0402]
R8  0R  [0402]
R9  0R  [0402]
R10  value 330ohm  [res_0402_R - modified]  (hidden comment: Res3)
R11  NC  [0402]
R18  value 330ohm  [res_0402_R - modified]  (hidden comment: Res3)
R19  NC  [0402]
R20  NC  [0402]
U6  nRF52832-QFAA  [QFN40P600X600X90-48N]
X1  FA-128 32.0000MF10Z-AJ3-ND  [BT-XTAL_2016]
X2  ABS07AIG-32.768kHz-9-1-T  [XTAL_3215]
XX1  0  [0402]
XX2  NC  [INDC1005X04L]
XX3  NC  [INDC1005X04L]

### Ports
#DRDY_1V8, #DRDY_1V8_GAP, #RESET_1V8, CLKSEL_1V8, CM_CHARGE_ENA (bidir), CM_CHARGE_I (bidir), CONF_1, CONF_2, CONF_3, DRDY_N_TO_G, OE_LEVEL1, OE_LEVEL2, PWDN_1V8, START_1V8

### Harnesses
SPI: SCK, MISO, MOSI

### Nets
1V8: C35.1 C38.1 C42.1 P4.1 U6.13(VDD) U6.36(VDD) U6.48(VDD)
GND: A1.3(GND) C34.2 C35.2 C36.2 C37.2 C38.2 C39.2 C40.1 C41.1 C42.2 C43.1 C44.2 C45.2 D1.2(K) D2.2(K) P4.4 P4.6 R6.2 R8.2 R9.2 U6.31(VSS) U6.45(VSS) U6.49(GND) X1.2(GND) X1.4(GND) XX2.2 XX3.2
CM_charge_ena: R18.2 ; port CM_CHARGE_ENA
DEC1: C44.1 U6.1(DEC1)
DEC2: C40.2 U6.32(DEC2)
DEC3: C39.1 U6.33(DEC3)
DEC4: C43.2 L2.1 U6.46(DEC4)
P0.00/XL1: C34.1 U6.2(P0.00/XL1) X2.1(inp)
P0.01/XL2: C37.1 U6.3(P0.01/XL2) X2.2(out)
P0.21/Reset: P4.5 U6.24(P0.21/RESET)
P0.25: R18.1 U6.37(P0.25)
P0.26: U6.38(P0.26) ; port CM_CHARGE_I  [project net CM_charge_I]
P0.27: U6.39(P0.27)
P0.28/AIN4: U6.40(P0.28/AIN4)
P0.29/AIN5: U6.41(P0.29/AIN5)
P0.30/AIN6: U6.42(P0.30/AIN6)
P0.31/AIN7: U6.43(P0.31/AIN7)
PULP_SPI_1V8.MISO: U6.15(P0.12) ; harness SPI.MISO
PULP_SPI_1V8.MOSI: U6.14(P0.11) ; harness SPI.MOSI
PULP_SPI_1V8.SCK: U6.16(P0.13) ; harness SPI.SCK
RF: L4.2 XX1.1 XX2.1
SPI_CS0_1V8: U6.17(P0.14)
SWDCLK: P4.3 U6.25(SWDCLK)
SWDIO: P4.2 U6.26(SWDIO)
XC1: C36.1 U6.34(XC1) X1.1(inp)
XC2: C45.1 U6.35(XC2) X1.3(out)
NetA1_1: A1.1(feed) XX1.2 XX3.1
NetC41_2: C41.2 L4.1 U6.30(ANT)
NetD1_1: D1.1(A) R4.2
NetD2_1: D2.1(A) R10.2
NetL2_2: L2.2 L3.1
NetL3_2: L3.2 U6.47(DCC)
NetR1_1: R20.1 ; port OE_LEVEL1
NetR4_1: R4.1 U6.28(P0.23)
NetR6_1: R6.1 U6.12(P0.10)
NetR7_1: R19.2 ; port OE_LEVEL2
NetR8_1: R8.1 U6.11(P0.09)
NetR9_1: R9.1 U6.10(P0.08)
NetR10_1: R10.1 U6.29(P0.24)
NetR11_1: R11.1 ; port #DRDY_1V8_GAP
NetR11_2: R11.2 U6.22(P0.19) ; port #DRDY_1V8
NetR19_1: R19.1 U6.27(P0.22)
NetR20_2: R20.2 U6.23(P0.20)
NetU2_1: U6.5(P0.03/AIN1) ; port CLKSEL_1V8
NetU2_4: U6.6(P0.04/AIN2) ; port START_1V8
NetU2_5: U6.7(P0.05/AIN3) ; port #RESET_1V8
NetU2_6: U6.8(P0.06) ; port PWDN_1V8
NetU5_A36: U6.19(P0.16) ; port CONF_1
NetU5_A37: U6.20(P0.17) ; port CONF_2
NetU5_A43: U6.21(P0.18) ; port CONF_3
NetU5_B39: U6.18(P0.15) ; port DRDY_N_TO_G

Not connected (* = marked no-connect by the designer): A1 2(not_connected); U6 4(P0.02/AIN0) 9(P0.07) 44(N.C.)*

### Notes on the sheet
- NRF52832 WITH DC/DC AND CHIP ANTENNA
- SPACE FOR ADDITIONAL MATCHING NETWORK
- P0.09 P0.10 PAD NFC
- (in symbol nRF52832-QFAB) nRF52832

### Library data of the parts
A1 = FR05-S1-N-0-102: Bluetooth antenna
C34 C36 C37 C45 = C0402-12p: Capacitor, NP0, ±2%; Note: 50V; Artikkelnr Noca: 20029159; Artikkelnr Simpro: N.A.; Part Number: C0402-12p; Manufacturer: *; Manufacturer Part Number: *; Datasheet: *; LatestRevisionDate: 2011-05-11; Pin Count: 2; Publisher: Nordic Semiconductor; Published: 2009-05-08; Value: 12pF; Supplier: *; Supplier part number: *; 2nd source Supplier: *; 2nd source part number: *; Footprint Doc: 0402
C35 = C0603-4µ7: Capacitor, X5R, ±10%; Note: 6.3V; Artikkelnr Noca: 20069060; Artikkelnr Simpro: N.A.; Part Number: C0603-4µ7; Manufacturer: *; Manufacturer Part Number: *; Datasheet: *; LatestRevisionDate: 2009-11-23; Pin Count: 2; Publisher: Nordic Semiconductor; Published: 2009-05-08; Value: 4.7µF; Supplier: *; Supplier part number: *; 2nd source Supplier: *; 2nd source part number: *; Footprint Doc: 0603
C38 C42 C44 = C0402-100n: Capacitor, X7R, ±10%; Note: 16V; Artikkelnr Noca: 20039200; Artikkelnr Simpro: N.A.; Part Number: C0402-100n; Manufacturer: *; Manufacturer Part Number: *; Datasheet: *; LatestRevisionDate: 2009-11-23; Pin Count: 2; Publisher: Nordic Semiconductor; Published: 2009-05-08; Value: 100nF; Supplier: *; Supplier part number: *; 2nd source Supplier: *; 2nd source part number: *; Footprint Doc: 0402
C39 = C0402-100p: Capacitor, NP0, ±5%; Note: 50V; Artikkelnr Noca: 20029135; Artikkelnr Simpro: N.A.; Part Number: C0402-100p; Manufacturer: *; Manufacturer Part Number: *; Datasheet: *; LatestRevisionDate: 2009-05-08; Pin Count: 2; Publisher: Nordic Semiconductor; Published: 2009-05-08; Value: 100pF; Supplier: *; Supplier part number: *; 2nd source Supplier: *; 2nd source part number: *; Footprint Doc: 0402
C40 = C0402-N.C.: Not mounted; Note: Chip Cap; Artikkelnr Noca: N.A.; Part Number: C0402-N.C.; Manufacturer: *; Manufacturer Part Number: *; Datasheet: *; LatestRevisionDate: 2009-05-08; Pin Count: 2; Publisher: Nordic Semiconductor; Published: 2009-05-08; Value: N.C.; Supplier: *; Supplier part number: *; 2nd source Supplier: *; 2nd source part number: *; Footprint Doc: 0402; Artikkelnr Simpro: N.A.
C41 = C0402-0.8p: Capacitor, NP0, ±5%; Note: 50V; Artikkelnr Noca: 20029147; Artikkelnr Simpro: N.A.; Part Number: C0402-0.8p; Manufacturer: *; Manufacturer Part Number: *; Datasheet: *; LatestRevisionDate: 2012-11-21; Pin Count: 2; Publisher: Nordic Semiconductor; Published: 2009-05-08; Value: 0.8pF; Supplier: *; Supplier part number: *; 2nd source Supplier: *; 2nd source part number: *; Footprint Doc: 0402
C43 = C0603-1µ0: Capacitor, X7R, ±10%; Note: 16V; Artikkelnr Noca: 20039335; Artikkelnr Simpro: N.A.; Part Number: C0603-1µ0; Manufacturer: *; Manufacturer Part Number: *; Datasheet: *; LatestRevisionDate: 2013-06-05; Pin Count: 2; Publisher: Nordic Semiconductor; Published: 2009-05-08; Value: 1.0µF; Supplier: *; Supplier part number: *; 2nd source Supplier: *; 2nd source part number: *; Footprint Doc: 0603
D1 D2 = LED3: Typical BLUE SiC LED; Published: 8-Jun-2000; LatestRevisionDate: 17-Dec-2003; LatestRevisionNote: PCB Footprint replaced.; DatasheetVersion: 16-Apr-2002; PackageVersion: 16-Apr-2002; PackageReference: 3.5X2.8X1.9; Publisher: Altium Limited; PackageDescription: SM LED; 2 C-Bend Leads; Body 3.5 x 2.8 x 1.9 mm, inc leads (LxWxH typ)
L2 = L0402-15n: High frequency chip inductor ±10%; Manufacturer: Taiyo Yuden; Manufacturer Part Number: HK100515NJ-T; 2nd source part number: 658-1328; Value: 15nH; Artikkelnr Noca: 33029323; Artikkelnr Simpro: N.A.; Part Number: L0402-15n; LatestRevisionDate: 2012-09-19; Pin Count: 2; Publisher: Nordic Semiconductor; Published: 2010-07-12; Note: High frequency chip inductor ±10%; Supplier: Digi-Key; Datasheet: http://www.yuden.co.jp/productdata/catalog/en/mlci04_e.pdf; Supplier part number: 587-1521-1-ND; 2nd source Supplier: Farnell; Footprint Doc: 0402
L3 = L0603-10µ: Chip inductor, IDC,min = 50 mA, ±20%; Manufacturer: Taiyo Yuden; Manufacturer Part Number: LBMF1608T100K; 2nd source part number: 178-6105; Value: 10µH; Note: LBMF1608T100K 10µH 80mA 0603; Artikkelnr Noca: 33029314; Artikkelnr Simpro: N.A.; Part Number: L0603-10µ; Datasheet: http://www.yuden.co.jp/ut/product/pdf/elb2_e.pdf; LatestRevisionDate: 2012-09-19; Pin Count: 2; Publisher: Nordic Semiconductor; Published: 2010-02-24; Supplier: Digi-Key; Supplier part number: 587-1714-1-ND; 2nd source Supplier: Farnell; Footprint Doc: 0603
L4 = L0402-3n9: High frequency chip inductor ±5%; Manufacturer: Murata; Manufacturer Part Number: LQP15MN3N9B02D; Artikkelnr Noca: 33029151; Artikkelnr Simpro: N.A.; Part Number: L0402-3n9; Datasheet: http://search.murata.co.jp/Ceramy/image/img/PDF/ENG/L0075S0084LQP15M.pdf; LatestRevisionDate: 2012-09-19; Pin Count: 2; Publisher: Nordic Semiconductor; Published: 2009-05-08; Value: 3.9nH; Note: High frequency chip inductor ±5%; Supplier: Digi-Key; Supplier part number: 490-1131-1-ND; 2nd source Supplier: *; 2nd source part number: *; Footprint Doc: 0402
P4 = Header 6: Header, 6-Pin; LatestRevisionDate: 17-Jul-2002; LatestRevisionNote: Re-released for DXP Platform.; Publisher: Altium Limited
R4 R6 R8-R11 R18-R20 XX1 = Res3: Resistor; Published: 8-Jun-2000; LatestRevisionDate: 29-May-2009; LatestRevisionNote: IPC-7351 Footprint Added.; PackageReference: J1-0603; Publisher: Altium Limited; PackageDescription: Chip Resistor
  R6 R8 R9: Value: 0R
  R11 R19 R20: Value: NC
  XX1: Value: 0
U6 = nRF52832-QFAB: Multi-protocol Bluetooth Low Energy, ANT and 2.4GHz proprietary system-on-chip; Manufacturer: Nordic Semiconductor; Artikkelnr Noca: N.A.; Part Number: nRF52832-QFAA; Manufacturer Part Number: nRF52832-QFAA; Datasheet: *; LatestRevisionDate: 2016-11-24; Pin Count: 48; Publisher: Nordic Semiconductor; Published: 2016-11-24; Value: nRF52832-QFAA; Note: *; Supplier: Nordic Semiconductor; Supplier part number: *; 2nd source Supplier: *; 2nd source part number: *; Footprint Doc: QFN-48; Artikkelnr Simpro: N.A.
X1 = XTAL_SMD2016_32MHz_8pF_General: XTAL SMD 2016, 32MHz, Cl=8pF, Total Tol: ±40ppm; Note: XTAL SMD 32.000MHz; Artikkelnr Noca: N.A.; Part Number: XTAL_SMD2016_32MHz_8pF_General; Manufacturer: *; Manufacturer Part Number: *; Datasheet: *; LatestRevisionDate: 2016-08-19; Pin Count: 4; Publisher: Nordic Semiconductor; Published: 2016-08-19; Value: 32MHz; Supplier: *; Supplier part number: *; 2nd source Supplier: *; 2nd source part number: *; Footprint Doc: XTAL_2016; Artikkelnr Simpro: N.A.
X2 = XTAL_SMD3215_32.768kHz_9pF_General: XTAL SMD 3215, 32.768kHz, Cl=9pF, Total Tol: ±50ppm; Note: XTAL SMD 32.768kHz; Artikkelnr Noca: N.A.; Part Number: XTAL_SMD3215_32.768kHz_9pF_General; Manufacturer: *; Manufacturer Part Number: *; Datasheet: *; LatestRevisionDate: 2016-08-19; Pin Count: 2; Publisher: Nordic Semiconductor; Published: 2016-08-19; Value: 32.768kHz; Supplier: *; Supplier part number: *; 2nd source Supplier: *; 2nd source part number: *; Footprint Doc: XTAL_3215; Artikkelnr Simpro: N.A.
XX2 XX3 = L0402-N.C.: Not mounted; Value: N.C.; Artikkelnr Noca: N.A.; Assembly: Not mounted; Part Number: L0402-N.C.; Manufacturer: *; Manufacturer Part Number: *; Datasheet: *; LatestRevisionDate: 2016-11-24; Pin Count: 2; Publisher: Nordic Semiconductor; Published: 2016-11-24; Note: *; Supplier: *; Supplier part number: *; 2nd source Supplier: *; 2nd source part number: *; Footprint Doc: 0402; Artikkelnr Simpro: N.A.; ComponentLink1Description: Datasheet; ComponentLink2Description: Supplier link

## Nets that join several sheets
1V8: Power (8 pins), GAPandPeripherals (19 pins), Communications (7 pins)
CHG_IN: BatteryCharge (C28.2 R12.2 U7.4), Power (P1.2)
GND: BatteryCharge (9 pins), Power (20 pins), GAPandPeripherals (38 pins), Communications (27 pins)
VCOM: Power (11 pins), GAPandPeripherals (C23.2 C24.2 U5.A34 U5.B31)
VCOM_CF: BatteryCharge (SW2.1), Power (5 pins)
CM_charge_ena: BatteryCharge (R15.2 U7.5), Communications (R18.2)
CM_charge_I: BatteryCharge (C52.2 R13.2), Communications (U6.38)
GPIO_A2_1V8: Power (U1.3), GAPandPeripherals (U5.A2)
GPIO_A3_1V8: Power (U1.1), GAPandPeripherals (U5.B1)
NetJ2_1: Power (P1.7), GAPandPeripherals (J2.1 U5.B28)
NetR1_1: Power (R1.1 U2.8), Communications (R20.1)
NetR7_1: Power (R7.1 U1.8), Communications (R19.2)
NetR11_1: GAPandPeripherals (U5.A41), Communications (R11.1)
NetR11_2: Power (U2.3), Communications (R11.2 U6.22)
NetU2_1: Power (U2.1), GAPandPeripherals (U5.B37), Communications (U6.5)
NetU2_4: Power (U2.4), GAPandPeripherals (U5.A42), Communications (U6.6)
NetU2_5: Power (U2.5), GAPandPeripherals (U5.B38), Communications (U6.7)
NetU2_6: Power (U2.6), GAPandPeripherals (U5.A40), Communications (U6.8)
NetU5_A36: GAPandPeripherals (U5.A36), Communications (U6.19)
NetU5_A37: GAPandPeripherals (U5.A37), Communications (U6.20)
NetU5_A43: GAPandPeripherals (U5.A43), Communications (U6.21)
NetU5_B39: GAPandPeripherals (U5.B39), Communications (U6.18)
PULP_SPI_1V8.MISO: Power (U1.5), GAPandPeripherals (U5.A4), Communications (U6.15)
PULP_SPI_1V8.MOSI: Power (U1.4), GAPandPeripherals (U5.B3), Communications (U6.14)
PULP_SPI_1V8.SCK: Power (U1.6), GAPandPeripherals (U5.B4), Communications (U6.16)
SPI_CS0_1V8: Power (U1.7), GAPandPeripherals (U5.A5), Communications (U6.17)